# Altium schematic sheet Main.SchDoc
size A4
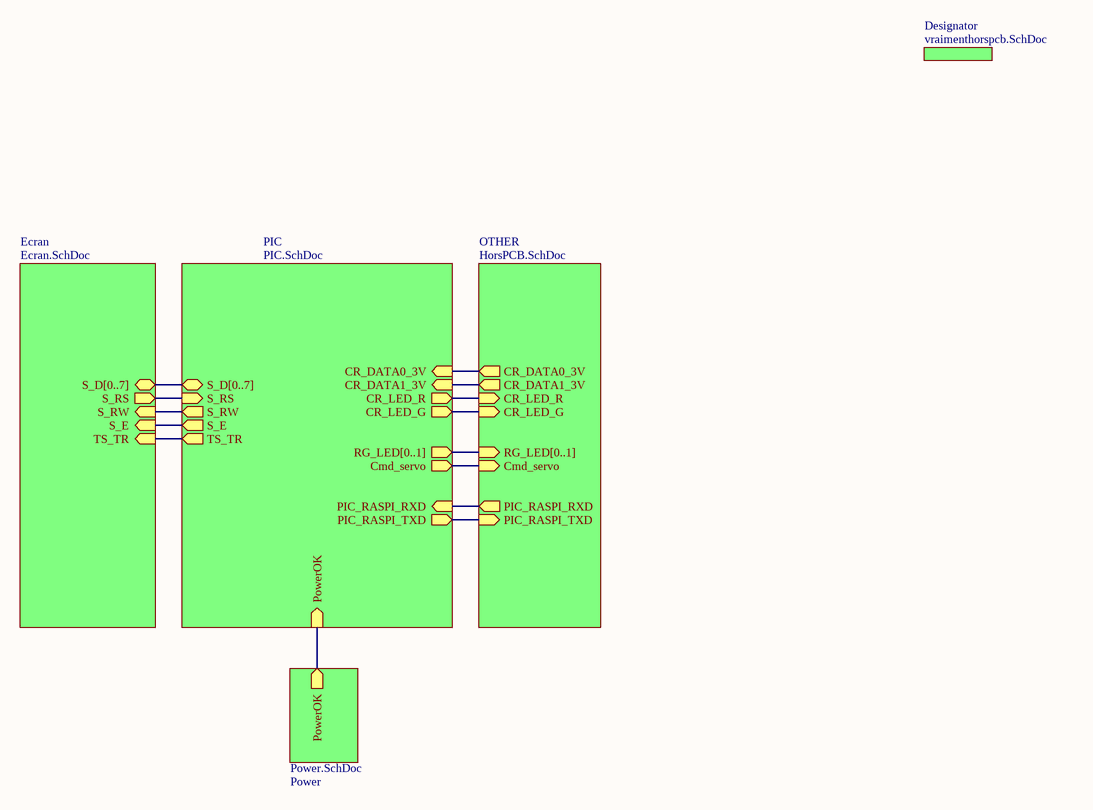
[diagram p0: Main.SchDoc]

## Sub-sheets
Designator = vraimenthorspcb.SchDoc: no entries
Ecran = Ecran.SchDoc: S_D[0..7] (bidir), S_RS (out), S_RW (in), S_E (in), TS_TR (in)
OTHER = HorsPCB.SchDoc: CR_DATA0_3V (out), CR_DATA1_3V (out), CR_LED_R (in), CR_LED_G (in), RG_LED[0..1] (in), Cmd_servo (in), PIC_RASPI_TXD (in), PIC_RASPI_RXD (out)
PIC = PIC.SchDoc: CR_DATA0_3V (in), CR_DATA1_3V (in), CR_LED_R (out), CR_LED_G (out), RG_LED[0..1] (out), Cmd_servo (out), PowerOK (in), S_RS (in), S_RW (out), S_E (out), TS_TR (out), S_D[0..7] (bidir), PIC_RASPI_RXD (in), PIC_RASPI_TXD (out)
Power = Power.SchDoc: PowerOK (out)

## Nets
(unnamed): sheet Ecran/S_D[0..7], sheet PIC/S_D[0..7]
(unnamed): sheet Ecran/S_RS, sheet PIC/S_RS
(unnamed): sheet Ecran/S_RW, sheet PIC/S_RW
(unnamed): sheet Ecran/S_E, sheet PIC/S_E
(unnamed): sheet Ecran/TS_TR, sheet PIC/TS_TR
(unnamed): sheet PIC/CR_DATA0_3V, sheet OTHER/CR_DATA0_3V
(unnamed): sheet PIC/CR_DATA1_3V, sheet OTHER/CR_DATA1_3V
(unnamed): sheet PIC/CR_LED_R, sheet OTHER/CR_LED_R
(unnamed): sheet PIC/CR_LED_G, sheet OTHER/CR_LED_G
(unnamed): sheet PIC/RG_LED[0..1], sheet OTHER/RG_LED[0..1]
(unnamed): sheet PIC/Cmd_servo, sheet OTHER/Cmd_servo
(unnamed): sheet PIC/PowerOK, sheet Power/PowerOK
(unnamed): sheet PIC/PIC_RASPI_RXD, sheet OTHER/PIC_RASPI_RXD
(unnamed): sheet PIC/PIC_RASPI_TXD, sheet OTHER/PIC_RASPI_TXD